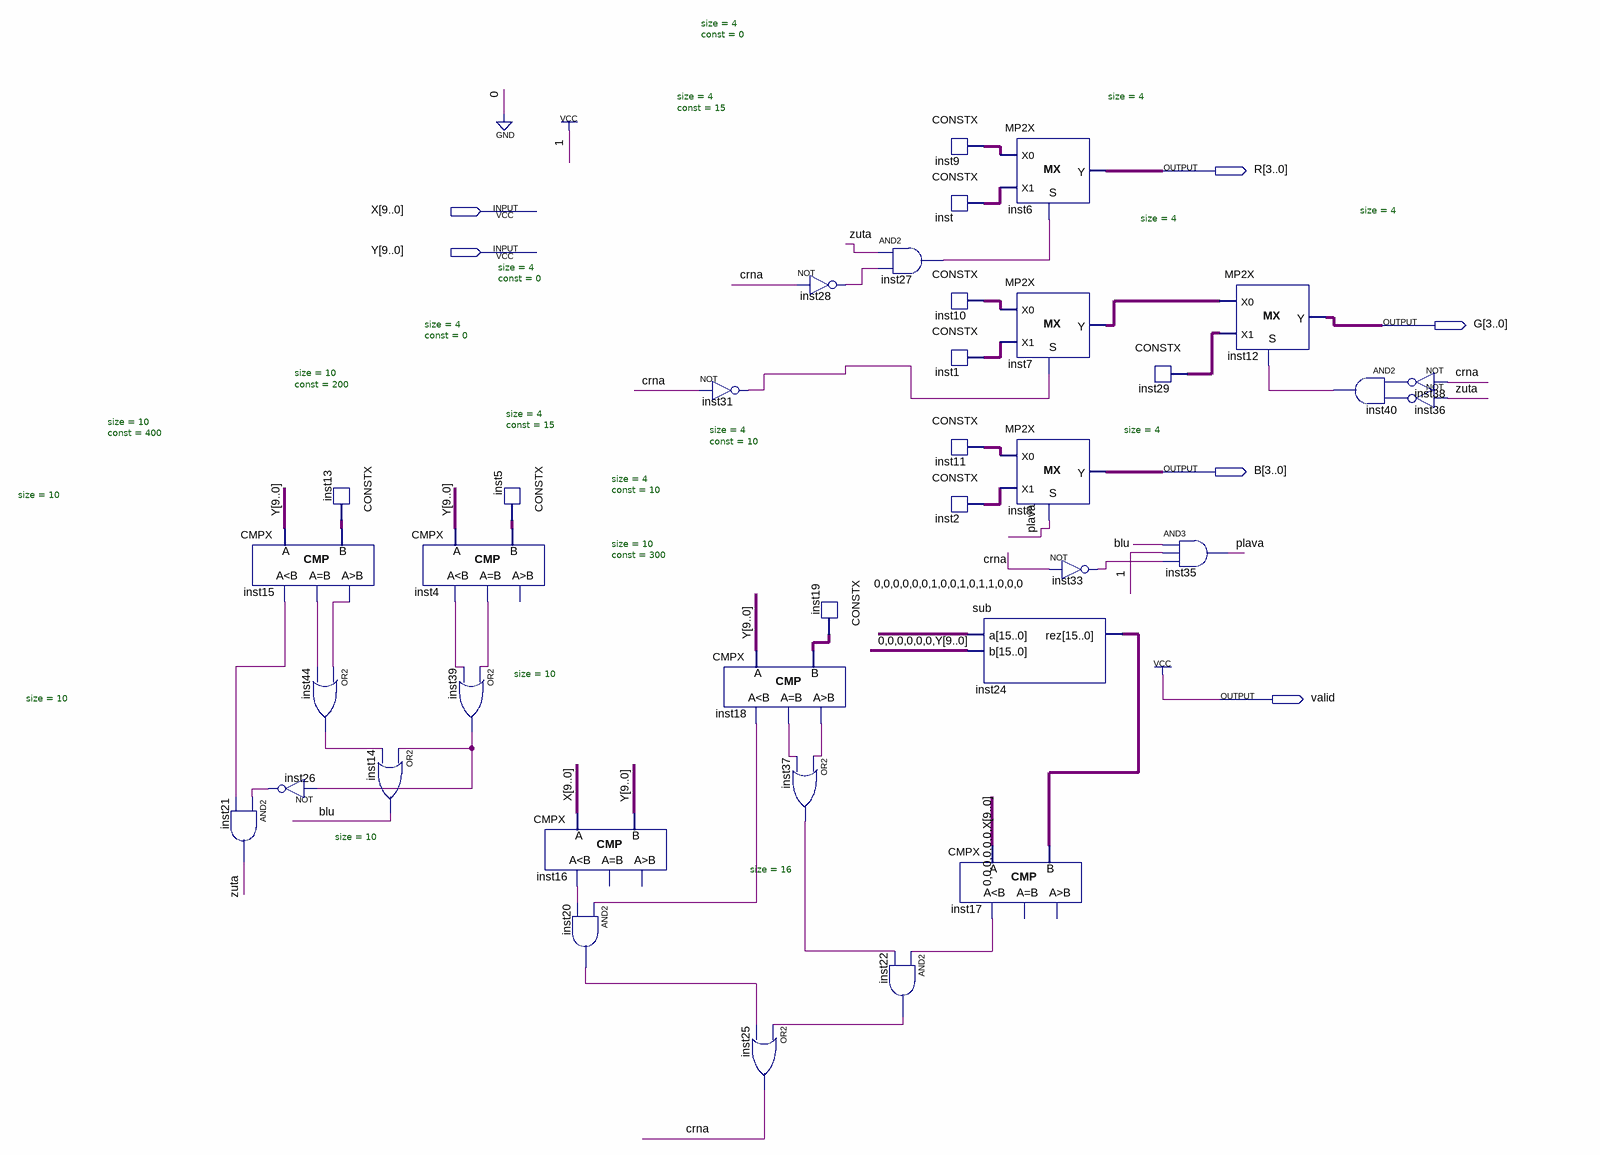
[diagram p0: schematic sheet]
// Quartus schematic Bahami.bdf as structural Verilog: 37 symbols, 6 pins
module Bahami (
  input  [9:0] X,
  input  [9:0] Y,
  output [3:0] R,
  output [3:0] G,
  output [3:0] B,
  output valid
);

  wire blu, crna, inst4_eq, inst4_ls, inst15_eq, inst15_gr, inst15_ls, inst16_ls, inst17_ls, inst18_eq,
       inst18_gr, inst18_ls, inst20_out, inst22_out, inst26_out, inst27_out, inst28_out, inst31_out,
       inst33_out, inst36_out, inst37_out, inst38_out, inst39_out, inst40_out, inst44_out, plava, zuta;
  wire [3:0] inst1_data, inst2_data, inst7_y, inst9_data, inst10_data, inst11_data, inst29_data, inst_data;
  wire [9:0] inst5_data, inst13_data, inst19_data;
  wire [15:0] inst24_rez;

  CMPX #(.size(10)) inst15 (.A(Y), .B(inst13_data), .ls(inst15_ls), .eq(inst15_eq), .gr(inst15_gr));
  and inst21 (zuta, inst26_out, inst15_ls);
  or inst44 (inst44_out, inst15_gr, inst15_eq);
  not inst26 (inst26_out, inst39_out);
  CONSTX #(.size(10), .\const (400)) inst13 (.data(inst13_data));
  or inst14 (blu, inst39_out, inst44_out);
  CMPX #(.size(10)) inst4 (.A(Y), .B(inst5_data), .ls(inst4_ls), .eq(inst4_eq));  // open: gr
  CONSTX #(.size(10), .\const (200)) inst5 (.data(inst5_data));
  or inst39 (inst39_out, inst4_eq, inst4_ls);
  CMPX #(.size(10)) inst16 (.A(X), .B(Y), .ls(inst16_ls));  // open: eq, gr
  and inst20 (inst20_out, inst18_ls, inst16_ls);
  not inst31 (inst31_out, crna);
  CMPX #(.size(10)) inst18 (.A(Y), .B(inst19_data), .ls(inst18_ls), .eq(inst18_eq), .gr(inst18_gr));
  or inst25 (crna, inst22_out, inst20_out);
  not inst28 (inst28_out, crna);
  CONSTX #(.size(10), .\const (300)) inst19 (.data(inst19_data));
  or inst37 (inst37_out, inst18_gr, inst18_eq);
  and inst27 (inst27_out, zuta, inst28_out);
  and inst22 (inst22_out, inst17_ls, inst37_out);
  CONSTX #(.size(4), .\const (0)) inst9 (.data(inst9_data));
  CONSTX #(.size(4), .\const (15)) inst (.data(inst_data));
  CONSTX #(.size(4), .\const (0)) inst10 (.data(inst10_data));
  CONSTX #(.size(4), .\const (15)) inst1 (.data(inst1_data));
  CONSTX #(.size(4), .\const (0)) inst11 (.data(inst11_data));
  CONSTX #(.size(4), .\const (10)) inst2 (.data(inst2_data));
  CMPX #(.size(16)) inst17 (.A({{6{1'b0}}, X}), .B(inst24_rez), .ls(inst17_ls));  // open: eq, gr
  MP2X #(.size(4)) inst6 (.S(inst27_out), .X0(inst9_data), .X1(inst_data), .Y(R));
  MP2X #(.size(4)) inst7 (.S(inst31_out), .X0(inst10_data), .X1(inst1_data), .Y(inst7_y));
  MP2X #(.size(4)) inst8 (.S(plava), .X0(inst11_data), .X1(inst2_data), .Y(B));
  sub inst24 (.a(16'b0000001001011000), .b({{6{1'b0}}, Y}), .rez(inst24_rez));
  not inst33 (inst33_out, crna);
  CONSTX #(.size(4), .\const (10)) inst29 (.data(inst29_data));
  and inst35 (plava, blu, 1'b1, inst33_out);
  MP2X #(.size(4)) inst12 (.S(inst40_out), .X0(inst7_y), .X1(inst29_data), .Y(G));
  and inst40 (inst40_out, inst38_out, inst36_out);
  not inst38 (inst38_out, crna);
  not inst36 (inst36_out, zuta);

  assign valid = 1'b1;
endmodule
